# Altium project CW312T_XC7A35T_AltiumProject.PrjPcb
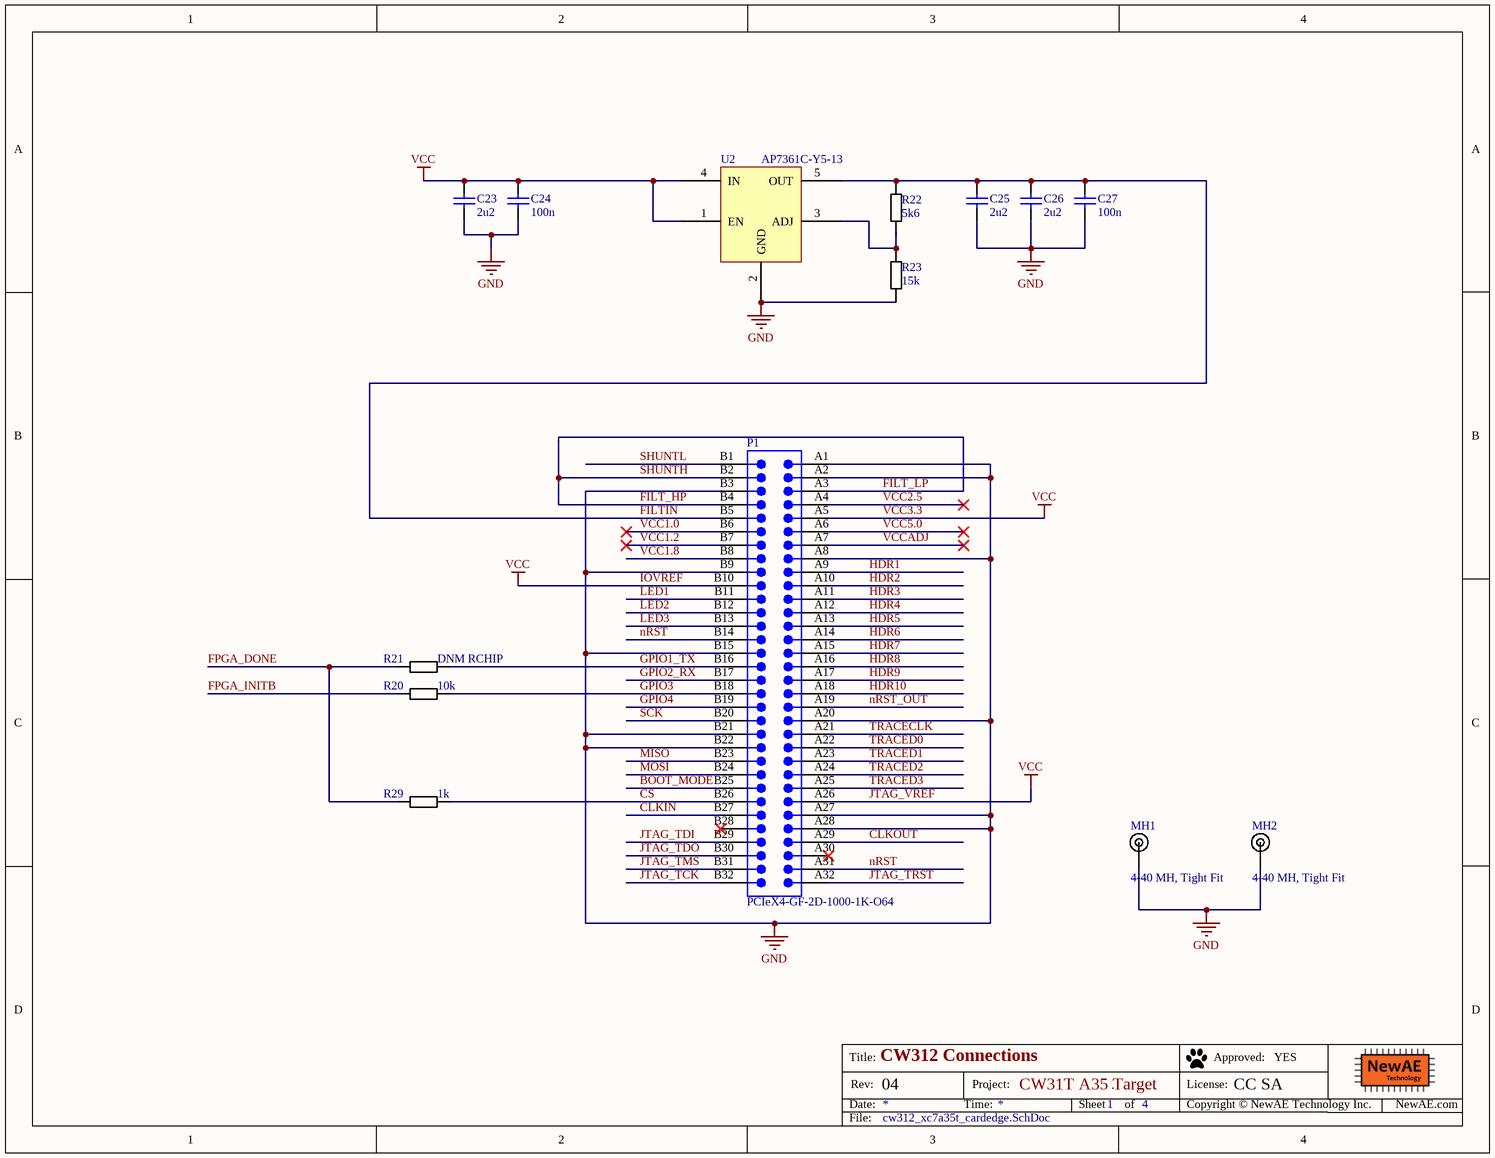
[diagram p0: cw312_xc7a35t_cardedge.SchDoc]
PrjLicense: CC SA; PrjName: CW31T A35 Target; PrjRev: 04
4 sheets, 64 parts. Net scope: global (net labels, ports and power ports of the same name join across sheets).
Board file: cw312_xc7a35t.PcbDoc
Sheets:
  cw312_xc7a35t_cardedge.SchDoc
  cw312_xc7a35t_fpga_pwr.SchDoc
  cw312_xc7a35t_fpga_cfg.SchDoc
  cw312_xc7A35t_fpga_io1.SchDoc

## Sheet cw312_xc7a35t_cardedge.SchDoc: CW312 Connections
size Letter; Organization: NewAE Technology Inc.; Address1: 1083 Queen St., Suite 196; Address2: Halifax; Address3: NS; Address4: Canada B3H 0B2; DocumentNumber: .; Revision: .; SheetNumber: 1; SheetTotal: 4; SheetApproved: YES

### Parts
C23  2u2  [CAPC0603_M]
C24  100n  [CAPC0402_M]
C25  2u2  [CAPC0603_M]
C26  2u2  [CAPC0603_M]
C27  100n  [CAPC0402_M]
MH1  4-40 MH, Tight Fit  [MOUNT_#4_TIGHT]
MH2  4-40 MH, Tight Fit  [MOUNT_#4_TIGHT]
P1  PCIeX4-GF-2D-1000-1K-O64  [PCIeX4-GF-2D-1000-1K-O64]  (no BOM)
R20  10k  [RESC1608X55N]
R21  DNM RCHIP  [RESC1608X55N]
R22  5k6  [RESC1608X55N]
R23  15k  [RESC1608X55N]
R29  1k  [RESC1608X55N]
U2  AP7361C-Y5-13  [SOT89-5]

### Nets
GND: C23.2 C24.2 C25.2 C26.2 C27.2 MH1.1 MH2.1 P1.A1 P1.A2 P1.A8 P1.A20 P1.A27 P1.A28 P1.B3 P1.B9 P1.B15 P1.B21 P1.B22 R23.2 U2.2(GND)
IOVREF: C23.1 C24.1 P1.A5 P1.A26 P1.B10 U2.1(EN) U2.4(IN)  [also labelled JTAG_VREF, VCC, VCC3.3]
BOOT_MODE: P1.B25
CLKIN: P1.B27
CLKOUT: P1.A29
CS: P1.B26 R29.2
FILT_HP: P1.A3 P1.B2 P1.B4  [also labelled FILT_LP, SHUNTH]
FILTIN: C25.1 C26.1 C27.1 P1.B5 R22.1 U2.5(OUT)
FPGA_DONE: R21.1 R29.1
FPGA_INITB: R20.1
GPIO1_TX: P1.B16 R21.2
GPIO2_RX: P1.B17
GPIO3: P1.B18 R20.2
GPIO4: P1.B19
HDR1: P1.A9
HDR2: P1.A10
HDR3: P1.A11
HDR4: P1.A12
HDR5: P1.A13
HDR6: P1.A14
HDR7: P1.A15
HDR8: P1.A16
HDR9: P1.A17
HDR10: P1.A18
JTAG_TCK: P1.B32
JTAG_TDI: P1.B29
JTAG_TDO: P1.B30
JTAG_TMS: P1.B31
JTAG_TRST: P1.A32
LED1: P1.B11
LED2: P1.B12
LED3: P1.B13
MISO: P1.B23
MOSI: P1.B24
nRST: P1.A31 P1.B14
nRST_OUT: P1.A19
SCK: P1.B20
SHUNTL: P1.B1
TRACECLK: P1.A21
TRACED0: P1.A22
TRACED1: P1.A23
TRACED2: P1.A24
TRACED3: P1.A25
VCC1.0: P1.B6
VCC1.2: P1.B7
VCC1.8: P1.B8
VCC2.5: P1.A4
VCC5.0: P1.A6
VCCADJ: P1.A7
NetR22_2: R22.2 R23.1 U2.3(ADJ)

Not connected (* = marked no-connect by the designer): P1 A30* B28*

### Notes on the sheet
- Title:
- Date:
- Rev:
- Time:
- Project:
- Sheet
- of
- License:
- Copyright © NewAE Technology Inc.
- Approved:
- NewAE.com
- File:

### Library data of the parts
C23 C25 C26 = CCHIP-2u2-0603: 2u2, 0603; Manufacture 1: Samsung; Manufacture Part Number 1: CL10B225KP8NNNC; Component Group: Capacitor; Case-EIA: 0603; Case-Metric: 1608; Rated Voltage: 10VDC; Part Number: CCHIP-2u2-0603; Footprint: 0603; Pin Count: 2; Supplier 1: Digi-Key; Supplier Part Number 1: 1276-1134-1-ND; Value: 2u2; Mounting Technology: SMT; Component Kind: Standard; Component Type: Standard
C24 C27 = CCHIP-100n-0402: 100n, 0402; Manufacture Part Number 1: CGA2B3X7R1V104K050BB; Component Group: Capacitor; Case-EIA: 0402; Part Number: CCHIP-100n-0402; Footprint: 0402; Pin Count: 2; Supplier 1: Digi-Key; Supplier Part Number 1: 445-6901-1-ND; Value: 100n; Mounting Technology: SMT; Component Kind: Standard; Component Type: Standard
MH1 MH2 = MOUNT_#4_TIGHT: Machine screw 4-40 Mounting Hole; Component Group: Mechanical; PP Material Stack: 0; Part Number: MOUNT_#4_TIGHT; Pin Count: 1; Component Kind: Mechanical; Component Type: Mechanical; PP Rotation: 0
P1 = CMP-0001-00031-2: Golden finger, PCIeX4, Dual, Opposite, Pitch 1mm, 64-Position; Mating Connector: Molex-87715-9106; Publisher: Altium; ClassName: Edge Connector; Datasheet Version: rev2.0, Apr-2007; Package Reference: PCIeX4-GF-2D-1000-1K-O64
R20 = RCHIP-10K-0603: 10k res, 0603, 1%, 1/10W; Manufacture 1: Yageo; Manufacture Part Number 1: RC0603FR-0710KL; Component Group: Resistor; Case-EIA: 0603; Case-Metric: 1608; Rated Power: 0.1W; Rated Voltage: 75VDC; Part Number: RCHIP-10K-0603; Footprint: 0603; Pin Count: 2; Supplier 1: Digi-Key; Supplier Part Number 1: 311-10.0KHRCT-ND; Value: 10k; Tolerance: 1%; Mounting Technology: SMT; Temperature Range: -55C to 155C; Component Kind: Standard; Component Type: Standard
R21 = RCHIP-DNM-0603: Do Not Mount Resistor; Case-EIA: 0603; Case-Metric: 1608; Part Number: RCHIP-DNM-0603; Component Group: Resistor; Footprint: 0603; Pin Count: 2; Mounting Technology: SMT; Component Kind: Standard; Component Type: Standard
R22 = RCHIP-5K6-0603: 5k6 res, 0603, 1%, 1/10W; Manufacture 1: Yageo; Manufacture Part Number 1: RC0603FR-075K6L; Component Group: Resistor; Case-EIA: 0603; Case-Metric: 1608; Rated Power: 0.1W; Rated Voltage: 75VDC; Part Number: RCHIP-5K6-0603; Footprint: 0603; Pin Count: 2; Mounting Technology: SMT; Component Kind: Standard; Component Type: Standard; Supplier 1: Digi-Key; Supplier Part Number 1: 311-5.60KHRCT-ND; Value: 5k6; Tolerance: 1%; Temperature Range: -55C to 155C
R23 = RCHIP-15k-0603: 15k res, 0603, 1%, 1/10W; Manufacture 1: Yageo; Manufacture Part Number 1: RC0603FR-0715KL; Component Group: Resistor; Case-EIA: 0603; Case-Metric: 1608; Rated Power: 0.1W; Rated Voltage: 75VDC; Part Number: RCHIP-15K-0603; Footprint: 0603; Pin Count: 2; Mounting Technology: SMT; Component Kind: Standard; Component Type: Standard; Supplier 1: Digi-Key; Supplier Part Number 1: 311-15.0KHRCT-ND; Value: 15k; Tolerance: 1%; Temperature Range: -55C to 155C
R29 = RCHIP-1K-0603: 1k res, 0603, 1%, 1/10W; Manufacture 1: Yageo; Manufacture Part Number 1: RC0603FR-071KL; Component Group: Resistor; Case-EIA: 0603; Case-Metric: 1608; Rated Power: 0.1W; Rated Voltage: 75VDC; Part Number: RCHIP-1K-0603; Footprint: 0603; Pin Count: 2; Supplier 1: Digi-Key; Supplier Part Number 1: 311-1.00KHRCT-ND; Value: 1k; Tolerance: 1%; Mounting Technology: SMT; Temperature Range: -55C to 155C; Component Kind: Standard; Component Type: Standard
U2 = AP7361C-Y5-13: Regulator, Adj, LDO, 1A; Manufacture 1: Diodes Inc; Component Group: Analog IC; PP Material Stack: 0; Part Number: AP7361C-Y5-13; Manufacture Part Number 1: AP7361C-Y5-13; Pin Count: 5; Supplier 1: Digi-Key; Supplier Part Number 1: AP7361C-Y5-13DICT-ND; Component Kind: Standard; Component Type: Standard; PP Rotation: 0; PP Rotation1: 0

## Sheet cw312_xc7a35t_fpga_pwr.SchDoc: Power Rails
size Letter; Organization: NewAE Technology Inc.; Address1: 127 Joseph Zatzman Dr; Address2: Dartmouth; Address3: NS; Address4: Canada B3B 1W1; DocumentNumber: .; Revision: .; SheetNumber: 2; SheetTotal: 4; SheetApproved: YES
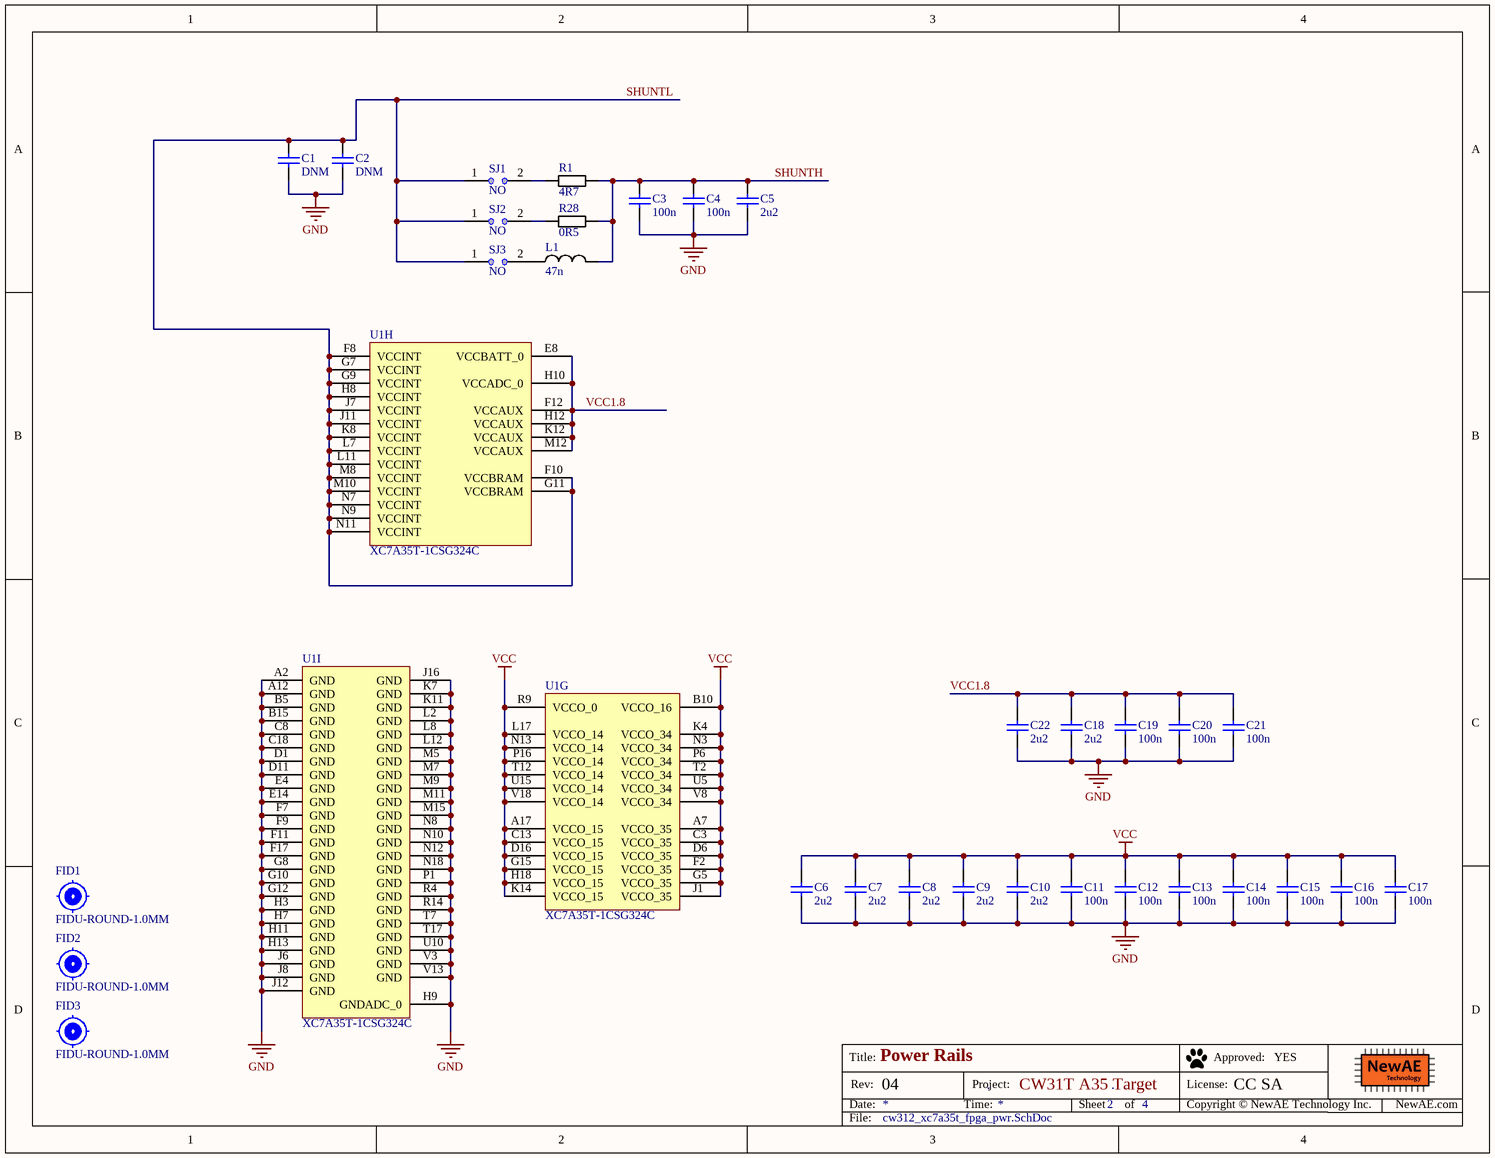
[diagram p1: cw312_xc7a35t_fpga_pwr.SchDoc]

### Parts
C1  DNM  [CAPC0603_M]
C2  DNM  [CAPC0603_M]
C3  100n  [CAPC0603_M]
C4  100n  [CAPC0603_M]
C5  2u2  [CAPC0603_M]
C6  2u2  [CAPC0603_M]
C7  2u2  [CAPC0603_M]
C8  2u2  [CAPC0603_M]
C9  2u2  [CAPC0603_M]
C10  2u2  [CAPC0603_M]
C11  100n  [CAPC0402_M]
C12  100n  [CAPC0402_M]
C13  100n  [CAPC0402_M]
C14  100n  [CAPC0402_M]
C15  100n  [CAPC0402_M]
C16  100n  [CAPC0402_M]
C17  100n  [CAPC0402_M]
C18  2u2  [CAPC0603_M]
C19  100n  [CAPC0402_M]
C20  100n  [CAPC0402_M]
C21  100n  [CAPC0402_M]
C22  2u2  [CAPC0603_M]
FID1  FIDU-ROUND-1.0MM  [FIDU-ROUND-1.0mm]  (no BOM)
FID2  FIDU-ROUND-1.0MM  [FIDU-ROUND-1.0mm]  (no BOM)
FID3  FIDU-ROUND-1.0MM  [FIDU-ROUND-1.0mm]  (no BOM)
L1  47n  [IND_0603]
R1  4R7  [RESC1608X55N]
R28  0R5  [RESC1608X55N]
SJ1  NO  [SJ_2S_NO]  (no BOM)
SJ2  NO  [SJ_2S_NO]  (no BOM)
SJ3  NO  [SJ_2S_NO]  (no BOM)
U1  XC7A35T-1CSG324C  [CSG324]  (parts G,H,I of 9)

### Nets
GND: C1.2 C2.2 C3.2 C4.2 C5.2 C6.2 C7.2 C8.2 C9.2 C10.2 C11.2 C12.2 C13.2 C14.2 C15.2 C16.2 C17.2 C18.2 C19.2 C20.2 C21.2 C22.2 U1.A2(GND) U1.A12(GND) U1.B5(GND) U1.B15(GND) U1.C8(GND) U1.C18(GND) U1.D1(GND) U1.D11(GND) U1.E4(GND) U1.E14(GND) U1.F7(GND) U1.F9(GND) U1.F11(GND) U1.F17(GND) U1.G8(GND) U1.G10(GND) U1.G12(GND) U1.H3(GND) U1.H7(GND) U1.H9(GNDADC_0) U1.H11(GND) U1.H13(GND) U1.J6(GND) U1.J8(GND) U1.J12(GND) U1.J16(GND) U1.K7(GND) U1.K11(GND) U1.L2(GND) U1.L8(GND) U1.L12(GND) U1.M5(GND) U1.M7(GND) U1.M9(GND) U1.M11(GND) U1.M15(GND) U1.N8(GND) U1.N10(GND) U1.N12(GND) U1.N18(GND) U1.P1(GND) U1.R4(GND) U1.R14(GND) U1.T7(GND) U1.T17(GND) U1.U10(GND) U1.V3(GND) U1.V13(GND)
VCC: C6.1 C7.1 C8.1 C9.1 C10.1 C11.1 C12.1 C13.1 C14.1 C15.1 C16.1 C17.1 U1.A7(VCCO_35) U1.A17(VCCO_15) U1.B10(VCCO_16) U1.C3(VCCO_35) U1.C13(VCCO_15) U1.D6(VCCO_35) U1.D16(VCCO_15) U1.F2(VCCO_35) U1.G5(VCCO_35) U1.G15(VCCO_15) U1.H18(VCCO_15) U1.J1(VCCO_35) U1.K4(VCCO_34) U1.K14(VCCO_15) U1.L17(VCCO_14) U1.N3(VCCO_34) U1.N13(VCCO_14) U1.P6(VCCO_34) U1.P16(VCCO_14) U1.R9(VCCO_0) U1.T2(VCCO_34) U1.T12(VCCO_14) U1.U5(VCCO_34) U1.U15(VCCO_14) U1.V8(VCCO_34) U1.V18(VCCO_14)  [project net IOVREF]
SHUNTH: C3.1 C4.1 C5.1 L1.2 R1.2 R28.2  [project net FILT_HP]
SHUNTL: C1.1 C2.1 SJ1.1 SJ2.1 SJ3.1 U1.F8(VCCINT) U1.F10(VCCBRAM) U1.G7(VCCINT) U1.G9(VCCINT) U1.G11(VCCBRAM) U1.H8(VCCINT) U1.J7(VCCINT) U1.J11(VCCINT) U1.K8(VCCINT) U1.L7(VCCINT) U1.L11(VCCINT) U1.M8(VCCINT) U1.M10(VCCINT) U1.N7(VCCINT) U1.N9(VCCINT) U1.N11(VCCINT)
VCC1.8: C18.1 C19.1 C20.1 C21.1 C22.1 U1.E8(VCCBATT_0) U1.F12(VCCAUX) U1.H10(VCCADC_0) U1.H12(VCCAUX) U1.K12(VCCAUX) U1.M12(VCCAUX)
NetL1_1: L1.1 SJ3.2
NetR1_1: R1.1 SJ1.2
NetR28_1: R28.1 SJ2.2

### Notes on the sheet
- Title:
- Date:
- Rev:
- Time:
- Project:
- Sheet
- of
- License:
- Copyright © NewAE Technology Inc.
- Approved:
- NewAE.com
- File:

### Library data of the parts
C1 C2 = CCHIP-100n-0603: Manufacture 1: Kemet; Manufacture Part Number 1: C0603C104K5RACTU; Component Group: Capacitor; Value: 100n; Case-EIA: 0603; Case-Metric: 1608; Rated Voltage: 50VDC; Part Number: CCHIP-100n-0603; Footprint: 0603; Pin Count: 2; Supplier 1: Digi-Key; Supplier Part Number 1: 399-5089-2-ND; Mounting Technology: SMT; Component Kind: Standard; Component Type: Standard
C3 C4 = CCHIP-100n-0603: 100n, 0603; Manufacture 1: Kemet; Manufacture Part Number 1: C0603C104K5RACTU; Component Group: Capacitor; Case-EIA: 0603; Case-Metric: 1608; Rated Voltage: 50VDC; Part Number: CCHIP-100n-0603; Footprint: 0603; Pin Count: 2; Supplier 1: Digi-Key; Supplier Part Number 1: 399-5089-2-ND; Value: 100n; Mounting Technology: SMT; Component Kind: Standard; Component Type: Standard
C5-C10 C18 C22 = CCHIP-2u2-0603: as C23 on sheet cw312_xc7a35t_cardedge; Part Number: CCHIP-2u2-0603; Footprint: 0603; Pin Count: 2; Supplier 1: Digi-Key; Value: 2u2; Mounting Technology: SMT; Component Kind: Standard; Component Type: Standard
  C5: Supplier Part Number 1: 1276-1134-2-ND
  C6-C10 C18 C22: Supplier Part Number 1: 1276-1134-1-ND
C11-C17 C19-C21 = CCHIP-100n-0402: as C24 on sheet cw312_xc7a35t_cardedge; Part Number: CCHIP-100n-0402; Footprint: 0402; Pin Count: 2; Supplier 1: Digi-Key; Supplier Part Number 1: 445-6901-1-ND; Value: 100n; Mounting Technology: SMT; Component Kind: Standard; Component Type: Standard
FID1-FID3 = FIDU-ROUND-1.0MM: ROUND FIDUCIAL; Component Group: PCB Feature; Part Number: FIDU-ROUND-1.0MM; Pin Count: 0; Component Type: Standard (No BOM)
L1 = LCHIP-47N-0603: FIXED IND 47NH 380MA 290 MOHM; Manufacture 1: Murata Electronics North America; Manufacture Part Number 1: LQW18AN47NJ00D; Component Group: Inductor; Case-EIA: 0603; Case-Metric: 1608; Tolerance: ±5%; PP Material Stack: 0; Part Number: LCHIP-47N-0603; Footprint: 0603; Pin Count: 2; Supplier 1: Digi-Key; Supplier Part Number 1: 490-6895-1-ND; Value: 47n; Mounting Technology: SMT; Component Kind: Standard; Component Type: Standard; PP Rotation: 0
R1 = RCHIP-4R7-0603: 4R7 res, 0603, 1%, 1/10W; Manufacture 1: Yageo; Manufacture Part Number 1: RC0603FR-074R7L; Component Group: Resistor; Case-EIA: 0603; Case-Metric: 1608; Rated Power: 0.1W; Rated Voltage: 75VDC; Part Number: RCHIP-4R7-0603; Footprint: 0603; Pin Count: 2; Supplier 1: Digi-Key; Supplier Part Number 1: YAG3371CT-ND; Value: 4R7; Tolerance: 1%; Mounting Technology: SMT; Temperature Range: -55C to 155C; Component Kind: Standard; Component Type: Standard
R28 = RCHIP-0R500-0603: 0R500 res, 0603, 1%, 1/10W; Manufacture 1: Yageo; Manufacture Part Number 1: RL0603FR-070R5L; Component Group: Resistor; Case-EIA: 0603; Case-Metric: 1608; Rated Power: 0.1W; Rated Voltage: 75VDC; Part Number: RCHIP-0R500-0603; Footprint: 0603; Pin Count: 2; Supplier 1: Digi-Key; Supplier Part Number 1: 311-.5QCT-ND; Value: 0R5; Tolerance: 1%; Mounting Technology: SMT; Temperature Range: -55C to 155C; Component Kind: Standard; Component Type: Standard
SJ1-SJ3 = SJ_2S_NO: Solder Jumper, NO; Component Group: PCB Feature; Part Number: SJ_2S_NO; Pin Count: 2; Mounting Technology: COPPER; Component Type: Standard (No BOM)
U1 = CMP-0383-00012-1: Artix-7 FPGA, 210 User I/Os, 0 GTP, 324-Ball BGA, Speed Grade 1, Commercial Grade, Pb-Free; Manufacturer: Xilinx; GTP: 0; Available User I/O: 210; Speed Grades: 1; Logic Cells: 33280; Total Block RAM: 1800 Kb; CMTs: 5; Maximum Distributed RAM: 400 Kb; ComponentLink2URL: http://www.xilinx.com/support/documentation/data_sheets/ds180_7Series_Overview.pdf; ComponentLink2Description: Datasheet; DatasheetVersion: Rev. 1.15; PackageDescription: 324-Ball Wire-Bond Chip-Scale BGA, Body 15 x 15 mm, Pitch 0.8 mm; ComponentLink4URL: http://www.xilinx.com/support/documentation/user_guides/ug475_7Series_Pkg_Pinout.pdf; PackageReference: CSG-324; Mounting Technology: Surface Mount; PackageVersion: Rev. 1.11; ComponentLink1Description: Manufacturer URL; ComponentLink3Description: Pinout; ComponentLink1URL: http://www.xilinx.com/; ComponentLink3URL: http://www.xilinx.com/support/documentation/user_guides/ug475_7Series_Pkg_Pinout.pdf; PartNumber: XC7A35T-1CSG324C; ComponentLink4Description: Package Specification; Operating Temperature Range: Commercial

## Sheet cw312_xc7a35t_fpga_cfg.SchDoc: Configuration
size Letter; Organization: NewAE Technology Inc.; Address1: 1083 Queen St., Suite 196; Address2: Halifax; Address3: NS; Address4: Canada B3H 0B2; DocumentNumber: .; Revision: .; SheetNumber: 3; SheetTotal: 4; SheetApproved: YES
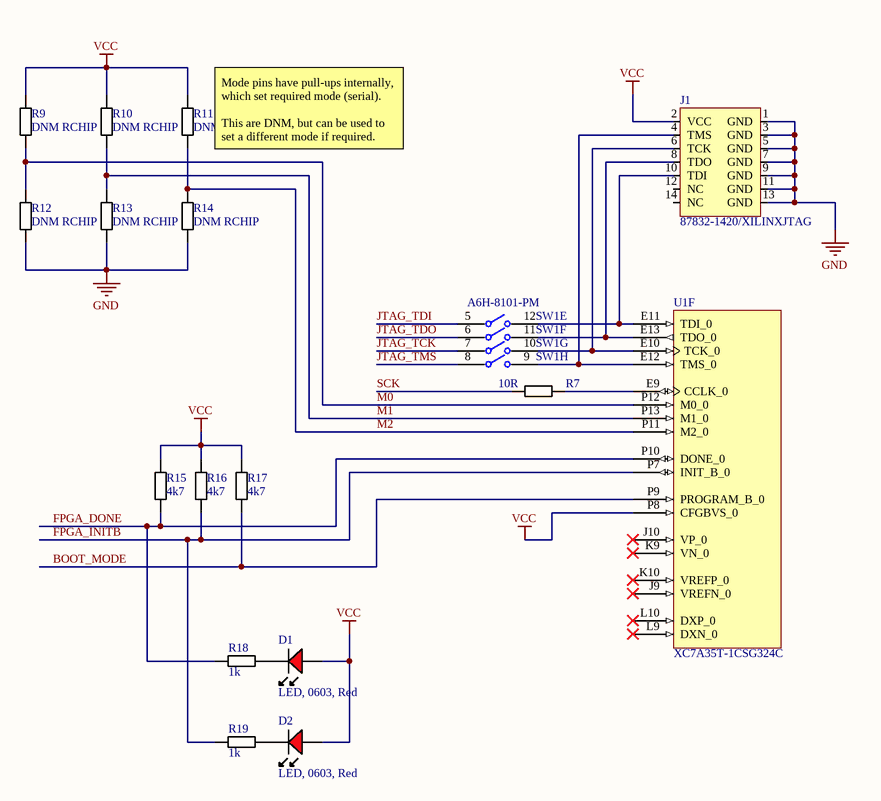
[diagram p2: cw312_xc7a35t_fpga_cfg.SchDoc]

### Parts
D1  LED, 0603, Red  [LED-0603-RED]
D2  LED, 0603, Red  [LED-0603-RED]
J1  87832-1420/XILINXJTAG  [87832-1420]
R7  10R  [RESC1608X55N]
R9  DNM RCHIP  [RESC1608X55N]
R10  DNM RCHIP  [RESC1608X55N]
R11  DNM RCHIP  [RESC1608X55N]
R12  DNM RCHIP  [RESC1608X55N]
R13  DNM RCHIP  [RESC1608X55N]
R14  DNM RCHIP  [RESC1608X55N]
R15  4k7  [RESC1608X55N]
R16  4k7  [RESC1608X55N]
R17  4k7  [RESC1608X55N]
R18  1k  [RESC1608X55N]
R19  1k  [RESC1608X55N]
SW1  A6H-8101-PM  [FP-A6H-8101-PM-MFG]  (parts E,F,G,H of 8)
U1  XC7A35T-1CSG324C  [CSG324]  (part F of 9)

### Nets
GND: J1.1(GND) J1.3(GND) J1.5(GND) J1.7(GND) J1.9(GND) J1.11(GND) J1.13(GND) R12.1 R13.1 R14.1
VCC: D1.A D2.A J1.2(VCC) R9.2 R10.2 R11.2 R15.1 R16.1 R17.1 U1.P8(CFGBVS_0)  [project net IOVREF]
BOOT_MODE: R17.2 U1.P9(PROGRAM_B_0)
FPGA_DONE: R15.2 R18.1 U1.P10(DONE_0)
FPGA_INITB: R16.2 R19.1 U1.P7(INIT_B_0)
JTAG_TCK: SW1.7
JTAG_TDI: SW1.5
JTAG_TDO: SW1.6
JTAG_TMS: SW1.8
M0: R9.1 R12.2 U1.P12(M0_0)
M1: R10.1 R13.2 U1.P13(M1_0)
M2: R11.1 R14.2 U1.P11(M2_0)
SCK: R7.1
NetD1_K: D1.K R18.2
NetD2_K: D2.K R19.2
NetJ1_4: J1.4(TMS) SW1.9 U1.E12(TMS_0)
NetJ1_6: J1.6(TCK) SW1.10 U1.E10(TCK_0)
NetJ1_8: J1.8(TDO) SW1.11 U1.E13(TDO_0)
NetJ1_10: J1.10(TDI) SW1.12 U1.E11(TDI_0)
NetR7_2: R7.2 U1.E9(CCLK_0)

Not connected (* = marked no-connect by the designer): J1 12(NC) 14(NC); U1 J9(VREFN_0)* J10(VP_0)* K9(VN_0)* K10(VREFP_0)* L9(DXN_0)* L10(DXP_0)*

### Notes on the sheet
- (near R11) Mode pins have pull-ups internally, which set required mode (serial).
  This are DNM, but can be used to set a different mode if required.
- Title:
- Date:
- Rev:
- Time:
- Project:
- Sheet
- of
- License:
- Copyright © NewAE Technology Inc.
- Approved:
- NewAE.com
- File:

### Library data of the parts
D1 D2 = LEDCHIP_0603_RED: Chip LED, Red; Manufacture 1: Kingbright; Manufacture Part Number 1: APT1608SRCPRV; Component Group: Optical; PP Material Stack: 15; PP Rotation: -90; Part Number: LEDCHIP_0603_RED; Pin Count: 2; Supplier 1: Digi-Key; Supplier Part Number 1: 754-1122-1-ND; Mounting Technology: SMT; Component Kind: Standard; Component Type: Standard
J1 = 87832-1420/XILINXJTAG: Molex 14-pin SMD, JTAG Pinout; Manufacture 1: Molex; Manufacture 1 Part Number: 87832-1420; Supplier 1: Digi-Key; Supplier Part Number 1: WM18641-ND
R7 = RCHIP-10R-0603: 10R res, 0603, 1%, 1/10W; Manufacture 1: Yageo; Manufacture Part Number 1: RC0603FR-0710RL; Component Group: Resistor; Case-EIA: 0603; Case-Metric: 1608; Rated Power: 0.1W; Rated Voltage: 75VDC; Part Number: RCHIP-10R-0603; Footprint: 0603; Pin Count: 2; Supplier 1: Digi-Key; Supplier Part Number 1: 311-10.0HRCT-ND; Value: 10R; Tolerance: 1%; Mounting Technology: SMT; Temperature Range: -55C to 155C; Component Kind: Standard; Component Type: Standard
R9-R14 = RCHIP-DNM-0603: as R21 on sheet cw312_xc7a35t_cardedge; Part Number: RCHIP-DNM-0603; Component Group: Resistor; Footprint: 0603; Pin Count: 2; Mounting Technology: SMT; Component Kind: Standard; Component Type: Standard
R15-R17 = RCHIP-4K7-0603: 4k7 res, 0603, 1%, 1/10W; Manufacture 1: Yageo; Manufacture Part Number 1: RC0603FR-074K7L; Component Group: Resistor; Case-EIA: 0603; Case-Metric: 1608; Rated Power: 0.1W; Rated Voltage: 75VDC; Part Number: RCHIP-4K7-0603; Footprint: 0603; Pin Count: 2; Supplier 1: Digi-Key; Supplier Part Number 1: 311-4.70KHRCT-ND; Value: 4k7; Tolerance: 1%; Mounting Technology: SMT; Temperature Range: -55C to 155C; Component Kind: Standard; Component Type: Standard
R18 R19 = RCHIP-1K-0603: as R29 on sheet cw312_xc7a35t_cardedge; Part Number: RCHIP-1K-0603; Footprint: 0603; Pin Count: 2; Supplier 1: Digi-Key; Supplier Part Number 1: 311-1.00KHRCT-ND; Value: 1k; Tolerance: 1%; Mounting Technology: SMT; Temperature Range: -55C to 155C; Component Kind: Standard; Component Type: Standard
SW1 = CMP-08827-000045-1: SWITCH SLIDE DIP SPST 25MA 24V; Number of Positions: 8; Actuator Type: Slide (Standard); Mechanical Life: 1000Cycles; Pitch: 0.05inch; Washable: No; Radiation Hardening: No; Max Operating Temperature: 70°C; Packaging: Tape and Reel; Max Current Rating: 25mA; Mount: Surface Mount; Voltage Rating (DC): 24V; Package Quantity: 4000; Length: 0.448inch; Depth: 6.7mm; Orientation: Straight; Throw Configuration: SPST; Termination: Gull Wing; Max Voltage Rating (DC): 24V; Series: A6H; Min Operating Temperature: -20°C; Current Rating: 25mA; Electrical Life: 1000Cycles
U1 = CMP-0383-00012-1: as U1 on sheet cw312_xc7a35t_fpga_pwr; Maximum Distributed RAM: 400 Kb; ComponentLink2URL: http://www.xilinx.com/support/documentation/data_sheets/ds180_7Series_Overview.pdf; ComponentLink2Description: Datasheet; DatasheetVersion: Rev. 1.15; PackageDescription: 324-Ball Wire-Bond Chip-Scale BGA, Body 15 x 15 mm, Pitch 0.8 mm; ComponentLink4URL: http://www.xilinx.com/support/documentation/user_guides/ug475_7Series_Pkg_Pinout.pdf; PackageReference: CSG-324; Mounting Technology: Surface Mount; PackageVersion: Rev. 1.11; ComponentLink1Description: Manufacturer URL; ComponentLink3Description: Pinout; ComponentLink1URL: http://www.xilinx.com/; ComponentLink3URL: http://www.xilinx.com/support/documentation/user_guides/ug475_7Series_Pkg_Pinout.pdf; PartNumber: XC7A35T-1CSG324C; ComponentLink4Description: Package Specification; Operating Temperature Range: Commercial

## Sheet cw312_xc7A35t_fpga_io1.SchDoc: I/O Pins
size Letter; Organization: NewAE Technology Inc.; Address1: 1083 Queen St., Suite 196; Address2: Halifax; Address3: NS; Address4: Canada B3H 0B2; SheetNumber: 4; SheetTotal: 4; SheetApproved: NO
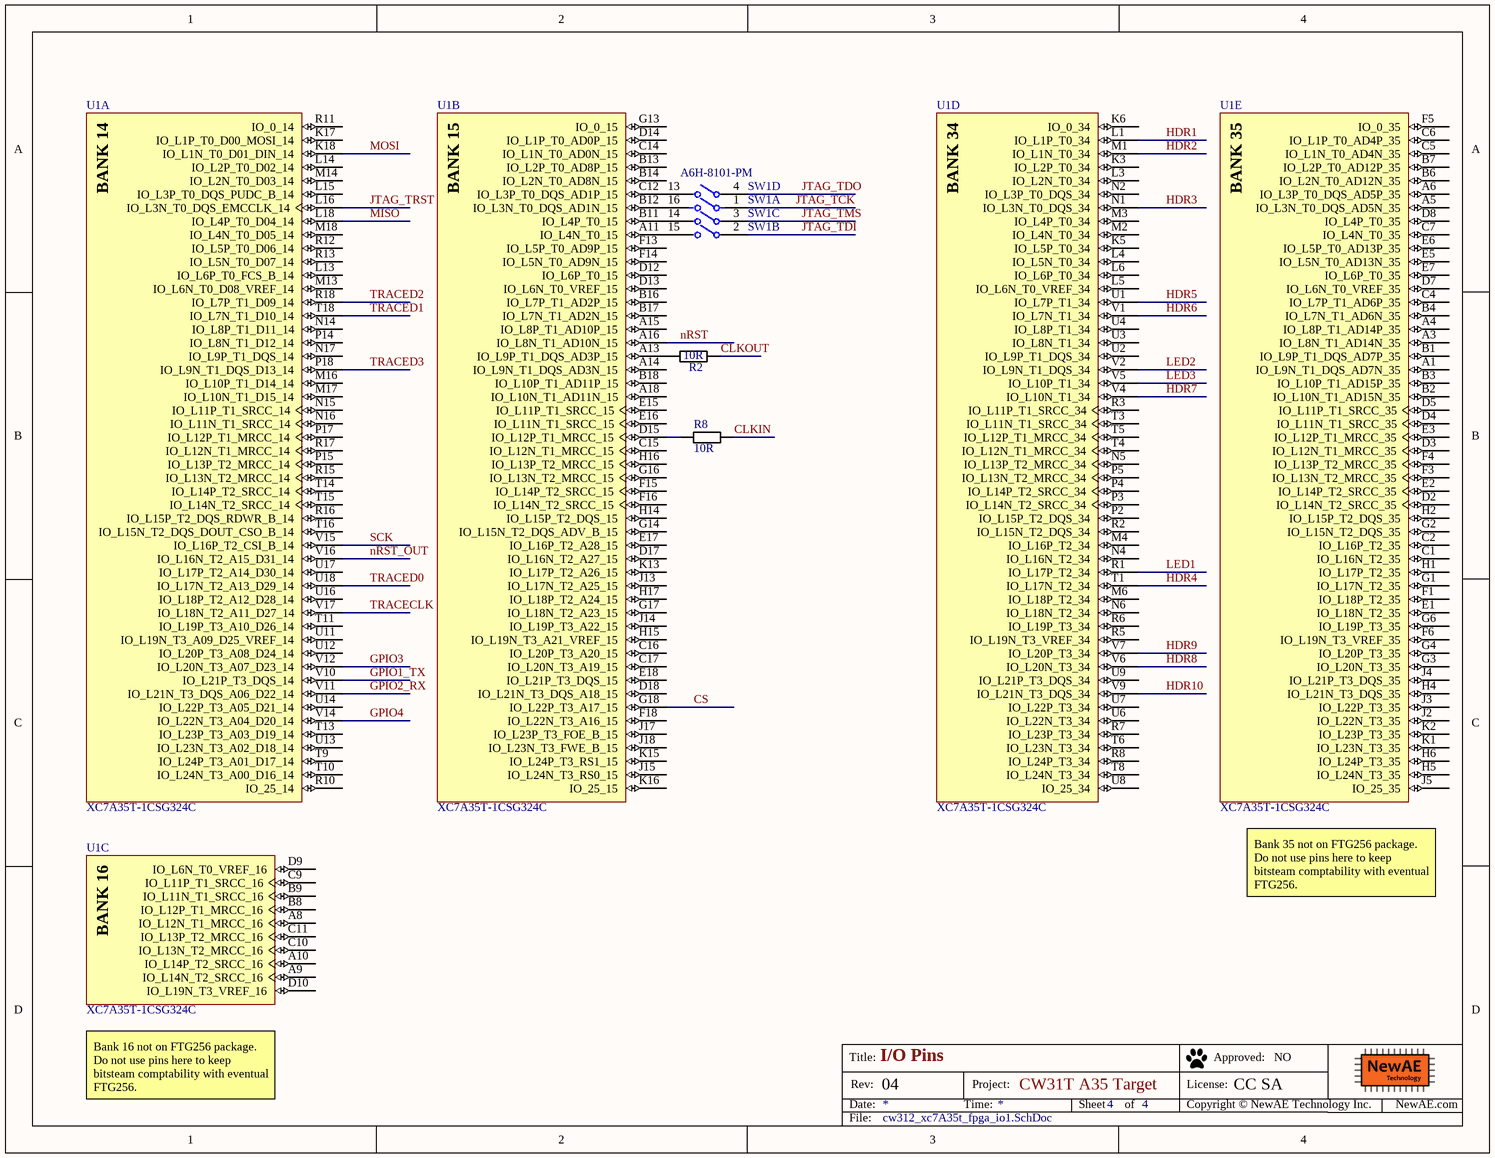
[diagram p3: cw312_xc7A35t_fpga_io1.SchDoc]

### Parts
R2  10R  [RESC1608X55N]
R8  10R  [RESC1608X55N]
SW1  A6H-8101-PM  [FP-A6H-8101-PM-MFG]  (parts A,B,C,D of 8)
U1  XC7A35T-1CSG324C  [CSG324]  (parts A,B,C,D,E of 9)

### Nets
CLKIN: R8.1
CLKOUT: R2.1
CS: U1.G18(IO_L22P_T3_A17_15)
GPIO1_TX: U1.V10(IO_L21P_T3_DQS_14)
GPIO2_RX: U1.V11(IO_L21N_T3_DQS_A06_D22_14)
GPIO3: U1.V12(IO_L20N_T3_A07_D23_14)
GPIO4: U1.V14(IO_L22N_T3_A04_D20_14)
HDR1: U1.L1(IO_L1P_T0_34)
HDR2: U1.M1(IO_L1N_T0_34)
HDR3: U1.N1(IO_L3N_T0_DQS_34)
HDR4: U1.T1(IO_L17N_T2_34)
HDR5: U1.U1(IO_L7P_T1_34)
HDR6: U1.V1(IO_L7N_T1_34)
HDR7: U1.V4(IO_L10N_T1_34)
HDR8: U1.V6(IO_L20N_T3_34)
HDR9: U1.V7(IO_L20P_T3_34)
HDR10: U1.V9(IO_L21N_T3_DQS_34)
JTAG_TCK: SW1.1
JTAG_TDI: SW1.2
JTAG_TDO: SW1.4
JTAG_TMS: SW1.3
JTAG_TRST: U1.L16(IO_L3N_T0_DQS_EMCCLK_14)
LED1: U1.R1(IO_L17P_T2_34)
LED2: U1.V2(IO_L9N_T1_DQS_34)
LED3: U1.V5(IO_L10P_T1_34)
MISO: U1.L18(IO_L4P_T0_D04_14)
MOSI: U1.K18(IO_L1N_T0_D01_DIN_14)
nRST: U1.A16(IO_L8N_T1_AD10N_15)
nRST_OUT: U1.V16(IO_L16N_T2_A15_D31_14)
SCK: U1.V15(IO_L16P_T2_CSI_B_14)
TRACECLK: U1.V17(IO_L18N_T2_A11_D27_14)
TRACED0: U1.U18(IO_L17N_T2_A13_D29_14)
TRACED1: U1.T18(IO_L7N_T1_D10_14)
TRACED2: U1.R18(IO_L7P_T1_D09_14)
TRACED3: U1.P18(IO_L9N_T1_DQS_D13_14)
NetR2_2: R2.2 U1.A13(IO_L9P_T1_DQS_AD3P_15)
NetR8_2: R8.2 U1.D15(IO_L12P_T1_MRCC_15)
NetSW1_13: SW1.13 U1.C12(IO_L3P_T0_DQS_AD1P_15)
NetSW1_14: SW1.14 U1.B11(IO_L4P_T0_15)
NetSW1_15: SW1.15 U1.A11(IO_L4N_T0_15)
NetSW1_16: SW1.16 U1.B12(IO_L3N_T0_DQS_AD1N_15)

Not connected (* = marked no-connect by the designer): U1 A1(IO_L9N_T1_DQS_AD7N_35) A3(IO_L8N_T1_AD14N_35) A4(IO_L8P_T1_AD14P_35) A5(IO_L3N_T0_DQS_AD5N_35) A6(IO_L3P_T0_DQS_AD5P_35) A8(IO_L12N_T1_MRCC_16) A9(IO_L14N_T2_SRCC_16) A10(IO_L14P_T2_SRCC_16) A14(IO_L9N_T1_DQS_AD3N_15) A15(IO_L8P_T1_AD10P_15) A18(IO_L10N_T1_AD11N_15) B1(IO_L9P_T1_DQS_AD7P_35) B2(IO_L10N_T1_AD15N_35) B3(IO_L10P_T1_AD15P_35) B4(IO_L7N_T1_AD6N_35) B6(IO_L2N_T0_AD12N_35) B7(IO_L2P_T0_AD12P_35) B8(IO_L12P_T1_MRCC_16) B9(IO_L11N_T1_SRCC_16) B13(IO_L2P_T0_AD8P_15) B14(IO_L2N_T0_AD8N_15) B16(IO_L7P_T1_AD2P_15) B17(IO_L7N_T1_AD2N_15) B18(IO_L10P_T1_AD11P_15) C1(IO_L16N_T2_35) C2(IO_L16P_T2_35) C4(IO_L7P_T1_AD6P_35) C5(IO_L1N_T0_AD4N_35) C6(IO_L1P_T0_AD4P_35) C7(IO_L4N_T0_35) C9(IO_L11P_T1_SRCC_16) C10(IO_L13N_T2_MRCC_16) C11(IO_L13P_T2_MRCC_16) C14(IO_L1N_T0_AD0N_15) C15(IO_L12N_T1_MRCC_15) C16(IO_L20P_T3_A20_15) C17(IO_L20N_T3_A19_15) D2(IO_L14N_T2_SRCC_35) D3(IO_L12N_T1_MRCC_35) D4(IO_L11N_T1_SRCC_35) D5(IO_L11P_T1_SRCC_35) D7(IO_L6N_T0_VREF_35) D8(IO_L4P_T0_35) D9(IO_L6N_T0_VREF_16) D10(IO_L19N_T3_VREF_16) D12(IO_L6P_T0_15) D13(IO_L6N_T0_VREF_15) D14(IO_L1P_T0_AD0P_15) D17(IO_L16N_T2_A27_15) D18(IO_L21N_T3_DQS_A18_15) E1(IO_L18N_T2_35) E2(IO_L14P_T2_SRCC_35) E3(IO_L12P_T1_MRCC_35) E5(IO_L5N_T0_AD13N_35) E6(IO_L5P_T0_AD13P_35) E7(IO_L6P_T0_35) E15(IO_L11P_T1_SRCC_15) E16(IO_L11N_T1_SRCC_15) E17(IO_L16P_T2_A28_15) E18(IO_L21P_T3_DQS_15) F1(IO_L18P_T2_35) F3(IO_L13N_T2_MRCC_35) F4(IO_L13P_T2_MRCC_35) F5(IO_0_35) F6(IO_L19N_T3_VREF_35) F13(IO_L5P_T0_AD9P_15) F14(IO_L5N_T0_AD9N_15) F15(IO_L14P_T2_SRCC_15) F16(IO_L14N_T2_SRCC_15) F18(IO_L22N_T3_A16_15) G1(IO_L17N_T2_35) G2(IO_L15N_T2_DQS_35) G3(IO_L20N_T3_35) G4(IO_L20P_T3_35) G6(IO_L19P_T3_35) G13(IO_0_15) G14(IO_L15N_T2_DQS_ADV_B_15) G16(IO_L13N_T2_MRCC_15) G17(IO_L18N_T2_A23_15) H1(IO_L17P_T2_35) H2(IO_L15P_T2_DQS_35) H4(IO_L21N_T3_DQS_35) H5(IO_L24N_T3_35) H6(IO_L24P_T3_35) H14(IO_L15P_T2_DQS_15) H15(IO_L19N_T3_A21_VREF_15) H16(IO_L13P_T2_MRCC_15) H17(IO_L18P_T2_A24_15) J2(IO_L22N_T3_35) J3(IO_L22P_T3_35) J4(IO_L21P_T3_DQS_35) J5(IO_25_35) J13(IO_L17N_T2_A25_15) J14(IO_L19P_T3_A22_15) J15(IO_L24N_T3_RS0_15) J17(IO_L23P_T3_FOE_B_15) J18(IO_L23N_T3_FWE_B_15) K1(IO_L23N_T3_35) K2(IO_L23P_T3_35) K3(IO_L2P_T0_34) K5(IO_L5P_T0_34) K6(IO_0_34) K13(IO_L17P_T2_A26_15) K15(IO_L24P_T3_RS1_15) K16(IO_25_15) K17(IO_L1P_T0_D00_MOSI_14) L3(IO_L2N_T0_34) L4(IO_L5N_T0_34) L5(IO_L6N_T0_VREF_34) L6(IO_L6P_T0_34) L13(IO_L6P_T0_FCS_B_14) L14(IO_L2P_T0_D02_14) L15(IO_L3P_T0_DQS_PUDC_B_14) M2(IO_L4N_T0_34) M3(IO_L4P_T0_34) M4(IO_L16P_T2_34) M6(IO_L18P_T2_34) M13(IO_L6N_T0_D08_VREF_14) M14(IO_L2N_T0_D03_14) M16(IO_L10P_T1_D14_14) M17(IO_L10N_T1_D15_14) M18(IO_L4N_T0_D05_14) N2(IO_L3P_T0_DQS_34) N4(IO_L16N_T2_34) N5(IO_L13P_T2_MRCC_34) N6(IO_L18N_T2_34) N14(IO_L8P_T1_D11_14) N15(IO_L11P_T1_SRCC_14) N16(IO_L11N_T1_SRCC_14) N17(IO_L9P_T1_DQS_14) P2(IO_L15P_T2_DQS_34) P3(IO_L14N_T2_SRCC_34) P4(IO_L14P_T2_SRCC_34) P5(IO_L13N_T2_MRCC_34) P14(IO_L8N_T1_D12_14) P15(IO_L13P_T2_MRCC_14) P17(IO_L12P_T1_MRCC_14) R2(IO_L15N_T2_DQS_34) R3(IO_L11P_T1_SRCC_34) R5(IO_L19N_T3_VREF_34) R6(IO_L19P_T3_34) R7(IO_L23P_T3_34) R8(IO_L24P_T3_34) R10(IO_25_14) R11(IO_0_14) R12(IO_L5P_T0_D06_14) R13(IO_L5N_T0_D07_14) R15(IO_L13N_T2_MRCC_14) R16(IO_L15P_T2_DQS_RDWR_B_14) R17(IO_L12N_T1_MRCC_14) T3(IO_L11N_T1_SRCC_34) T4(IO_L12N_T1_MRCC_34) T5(IO_L12P_T1_MRCC_34) T6(IO_L23N_T3_34) T8(IO_L24N_T3_34) T9(IO_L24P_T3_A01_D17_14) T10(IO_L24N_T3_A00_D16_14) T11(IO_L19P_T3_A10_D26_14) T13(IO_L23P_T3_A03_D19_14) T14(IO_L14P_T2_SRCC_14) T15(IO_L14N_T2_SRCC_14) T16(IO_L15N_T2_DQS_DOUT_CSO_B_14) U2(IO_L9P_T1_DQS_34) U3(IO_L8N_T1_34) U4(IO_L8P_T1_34) U6(IO_L22N_T3_34) U7(IO_L22P_T3_34) U8(IO_25_34) U9(IO_L21P_T3_DQS_34) U11(IO_L19N_T3_A09_D25_VREF_14) U12(IO_L20P_T3_A08_D24_14) U13(IO_L23N_T3_A02_D18_14) U14(IO_L22P_T3_A05_D21_14) U16(IO_L18P_T2_A12_D28_14) U17(IO_L17P_T2_A14_D30_14)

### Notes on the sheet
- (near U1) Bank 35 not on FTG256 package. Do not use pins here to keep bitsteam comptability with eventual FTG256.
- (near U1) Bank 16 not on FTG256 package. Do not use pins here to keep bitsteam comptability with eventual FTG256.
- Title:
- Date:
- Rev:
- Time:
- Project:
- Sheet
- of
- License:
- Copyright © NewAE Technology Inc.
- Approved:
- NewAE.com
- File:
- (in symbol CMP-0383-00012-1, part A) BANK 14
- (in symbol CMP-0383-00012-1, part B) BANK 15
- (in symbol CMP-0383-00012-1, part C) BANK 16
- (in symbol CMP-0383-00012-1, part D) BANK 34
- (in symbol CMP-0383-00012-1, part E) BANK 35

### Library data of the parts
R2 R8 = RCHIP-10R-0603: as R7 on sheet cw312_xc7a35t_fpga_cfg; Part Number: RCHIP-10R-0603; Footprint: 0603; Pin Count: 2; Supplier 1: Digi-Key; Supplier Part Number 1: 311-10.0HRCT-ND; Value: 10R; Tolerance: 1%; Mounting Technology: SMT; Temperature Range: -55C to 155C; Component Kind: Standard; Component Type: Standard
SW1 = CMP-08827-000045-1: as SW1 on sheet cw312_xc7a35t_fpga_cfg; Radiation Hardening: No; Max Operating Temperature: 70°C; Packaging: Tape and Reel; Max Current Rating: 25mA; Mount: Surface Mount; Voltage Rating (DC): 24V; Package Quantity: 4000; Length: 0.448inch; Depth: 6.7mm; Orientation: Straight; Throw Configuration: SPST; Termination: Gull Wing; Max Voltage Rating (DC): 24V; Series: A6H; Min Operating Temperature: -20°C; Current Rating: 25mA; Electrical Life: 1000Cycles
U1 = CMP-0383-00012-1: as U1 on sheet cw312_xc7a35t_fpga_pwr; Maximum Distributed RAM: 400 Kb; ComponentLink2URL: http://www.xilinx.com/support/documentation/data_sheets/ds180_7Series_Overview.pdf; ComponentLink2Description: Datasheet; DatasheetVersion: Rev. 1.15; PackageDescription: 324-Ball Wire-Bond Chip-Scale BGA, Body 15 x 15 mm, Pitch 0.8 mm; ComponentLink4URL: http://www.xilinx.com/support/documentation/user_guides/ug475_7Series_Pkg_Pinout.pdf; PackageReference: CSG-324; Mounting Technology: Surface Mount; PackageVersion: Rev. 1.11; ComponentLink1Description: Manufacturer URL; ComponentLink3Description: Pinout; ComponentLink1URL: http://www.xilinx.com/; ComponentLink3URL: http://www.xilinx.com/support/documentation/user_guides/ug475_7Series_Pkg_Pinout.pdf; PartNumber: XC7A35T-1CSG324C; ComponentLink4Description: Package Specification; Operating Temperature Range: Commercial

## Nets that join several sheets
GND: cw312_xc7a35t_cardedge (20 pins), cw312_xc7a35t_fpga_pwr (70 pins), cw312_xc7a35t_fpga_cfg (10 pins)
IOVREF: cw312_xc7a35t_cardedge (7 pins), cw312_xc7a35t_fpga_pwr (38 pins), cw312_xc7a35t_fpga_cfg (10 pins)
BOOT_MODE: cw312_xc7a35t_cardedge (P1.B25), cw312_xc7a35t_fpga_cfg (R17.2 U1.P9)
CLKIN: cw312_xc7a35t_cardedge (P1.B27), cw312_xc7A35t_fpga_io1 (R8.1)
CLKOUT: cw312_xc7a35t_cardedge (P1.A29), cw312_xc7A35t_fpga_io1 (R2.1)
CS: cw312_xc7a35t_cardedge (P1.B26 R29.2), cw312_xc7A35t_fpga_io1 (U1.G18)
FILT_HP: cw312_xc7a35t_cardedge (P1.A3 P1.B2 P1.B4), cw312_xc7a35t_fpga_pwr (6 pins)
FPGA_DONE: cw312_xc7a35t_cardedge (R21.1 R29.1), cw312_xc7a35t_fpga_cfg (R15.2 R18.1 U1.P10)
FPGA_INITB: cw312_xc7a35t_cardedge (R20.1), cw312_xc7a35t_fpga_cfg (R16.2 R19.1 U1.P7)
GPIO1_TX: cw312_xc7a35t_cardedge (P1.B16 R21.2), cw312_xc7A35t_fpga_io1 (U1.V10)
GPIO2_RX: cw312_xc7a35t_cardedge (P1.B17), cw312_xc7A35t_fpga_io1 (U1.V11)
GPIO3: cw312_xc7a35t_cardedge (P1.B18 R20.2), cw312_xc7A35t_fpga_io1 (U1.V12)
GPIO4: cw312_xc7a35t_cardedge (P1.B19), cw312_xc7A35t_fpga_io1 (U1.V14)
HDR1: cw312_xc7a35t_cardedge (P1.A9), cw312_xc7A35t_fpga_io1 (U1.L1)
HDR2: cw312_xc7a35t_cardedge (P1.A10), cw312_xc7A35t_fpga_io1 (U1.M1)
HDR3: cw312_xc7a35t_cardedge (P1.A11), cw312_xc7A35t_fpga_io1 (U1.N1)
HDR4: cw312_xc7a35t_cardedge (P1.A12), cw312_xc7A35t_fpga_io1 (U1.T1)
HDR5: cw312_xc7a35t_cardedge (P1.A13), cw312_xc7A35t_fpga_io1 (U1.U1)
HDR6: cw312_xc7a35t_cardedge (P1.A14), cw312_xc7A35t_fpga_io1 (U1.V1)
HDR7: cw312_xc7a35t_cardedge (P1.A15), cw312_xc7A35t_fpga_io1 (U1.V4)
HDR8: cw312_xc7a35t_cardedge (P1.A16), cw312_xc7A35t_fpga_io1 (U1.V6)
HDR9: cw312_xc7a35t_cardedge (P1.A17), cw312_xc7A35t_fpga_io1 (U1.V7)
HDR10: cw312_xc7a35t_cardedge (P1.A18), cw312_xc7A35t_fpga_io1 (U1.V9)
JTAG_TCK: cw312_xc7a35t_cardedge (P1.B32), cw312_xc7a35t_fpga_cfg (SW1.7), cw312_xc7A35t_fpga_io1 (SW1.1)
JTAG_TDI: cw312_xc7a35t_cardedge (P1.B29), cw312_xc7a35t_fpga_cfg (SW1.5), cw312_xc7A35t_fpga_io1 (SW1.2)
JTAG_TDO: cw312_xc7a35t_cardedge (P1.B30), cw312_xc7a35t_fpga_cfg (SW1.6), cw312_xc7A35t_fpga_io1 (SW1.4)
JTAG_TMS: cw312_xc7a35t_cardedge (P1.B31), cw312_xc7a35t_fpga_cfg (SW1.8), cw312_xc7A35t_fpga_io1 (SW1.3)
JTAG_TRST: cw312_xc7a35t_cardedge (P1.A32), cw312_xc7A35t_fpga_io1 (U1.L16)
LED1: cw312_xc7a35t_cardedge (P1.B11), cw312_xc7A35t_fpga_io1 (U1.R1)
LED2: cw312_xc7a35t_cardedge (P1.B12), cw312_xc7A35t_fpga_io1 (U1.V2)
LED3: cw312_xc7a35t_cardedge (P1.B13), cw312_xc7A35t_fpga_io1 (U1.V5)
MISO: cw312_xc7a35t_cardedge (P1.B23), cw312_xc7A35t_fpga_io1 (U1.L18)
MOSI: cw312_xc7a35t_cardedge (P1.B24), cw312_xc7A35t_fpga_io1 (U1.K18)
nRST: cw312_xc7a35t_cardedge (P1.A31 P1.B14), cw312_xc7A35t_fpga_io1 (U1.A16)
nRST_OUT: cw312_xc7a35t_cardedge (P1.A19), cw312_xc7A35t_fpga_io1 (U1.V16)
SCK: cw312_xc7a35t_cardedge (P1.B20), cw312_xc7a35t_fpga_cfg (R7.1), cw312_xc7A35t_fpga_io1 (U1.V15)
SHUNTL: cw312_xc7a35t_cardedge (P1.B1), cw312_xc7a35t_fpga_pwr (21 pins)
TRACECLK: cw312_xc7a35t_cardedge (P1.A21), cw312_xc7A35t_fpga_io1 (U1.V17)
TRACED0: cw312_xc7a35t_cardedge (P1.A22), cw312_xc7A35t_fpga_io1 (U1.U18)
TRACED1: cw312_xc7a35t_cardedge (P1.A23), cw312_xc7A35t_fpga_io1 (U1.T18)
TRACED2: cw312_xc7a35t_cardedge (P1.A24), cw312_xc7A35t_fpga_io1 (U1.R18)
TRACED3: cw312_xc7a35t_cardedge (P1.A25), cw312_xc7A35t_fpga_io1 (U1.P18)
VCC1.8: cw312_xc7a35t_cardedge (P1.B8), cw312_xc7a35t_fpga_pwr (11 pins)